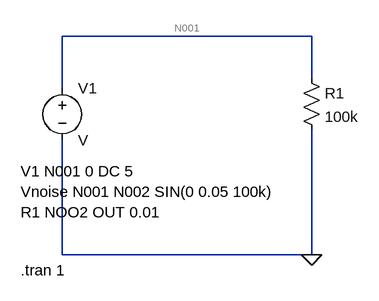
[diagram p0: schematic PIFilter.asc]
PIFilter.asc, the LTspice schematic file:
Version 4.1
SHEET 1 880 680
WIRE 304 0 -80 0
WIRE 304 64 304 0
WIRE -80 80 -80 0
WIRE -80 336 -80 160
WIRE 304 336 304 144
WIRE 304 336 -80 336
FLAG 304 336 0
SYMBOL voltage -80 64 R0
SYMATTR InstName V1
SYMBOL res 288 48 R0
SYMATTR InstName R1
SYMATTR Value 100k
TEXT -144 208 Left 2 !V1 N001 0 DC 5\nVnoise N001 N002 SIN(0 0.05 100k)\nR1 NOO2 OUT 0.01
TEXT -144 360 Left 2 !.tran 1

The netlist it stands for:
* PIFilter.asc
V1 N001 0 V
R1 N001 0 100k
V1 N001 0 DC 5
Vnoise N001 N002 SIN(0 0.05 100k)
R1 NOO2 OUT 0.01
.tran 1
.backanno
.end